# EAGLE schematic UTX_EE445M_Front_LiDAR_Board_1 (EAGLE 9.2.2)
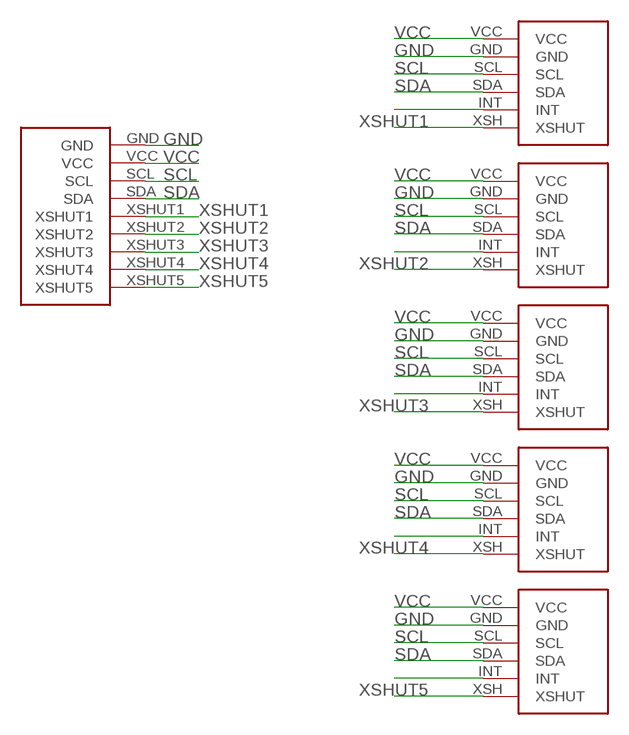
[diagram p0: schematic, sheet 1]

## Parts
U$1  UTX_EE445M_LIDAR_FRONT_BOARD_CONNECTOR_PTH  [UTX_EE445M_LIDAR_FRONT_BOARD_CONNECTOR_PTH]
U$2  LIDAR_VL53L0X_ATK_VERT  [LIDAR_VL53L0X_ATK_VERT]
U$3  LIDAR_VL53L0X_ATK_VERT  [LIDAR_VL53L0X_ATK_VERT]
U$4  LIDAR_VL53L0X_ATK_VERT  [LIDAR_VL53L0X_ATK_VERT]
U$5  LIDAR_VL53L0X_ATK_VERT  [LIDAR_VL53L0X_ATK_VERT]
U$6  LIDAR_VL53L0X_ATK_VERT  [LIDAR_VL53L0X_ATK_VERT]

## Nets
GND: U$1.GND U$2.GND U$3.GND U$4.GND U$5.GND U$6.GND
N$1: U$3.INT
N$2: U$6.INT
N$3: U$4.INT
N$5: U$5.INT
N$13: U$2.INT
SCL: U$1.SCL U$2.SCL U$3.SCL U$4.SCL U$5.SCL U$6.SCL
SDA: U$1.SDA U$2.SDA U$3.SDA U$4.SDA U$5.SDA U$6.SDA
VCC: U$1.VCC U$2.VCC U$3.VCC U$4.VCC U$5.VCC U$6.VCC
XSHUT1: U$1.XSHUT1 U$2.XSH(XSHUT)
XSHUT2: U$1.XSHUT2 U$3.XSH(XSHUT)
XSHUT3: U$1.XSHUT3 U$4.XSH(XSHUT)
XSHUT4: U$1.XSHUT4 U$5.XSH(XSHUT)
XSHUT5: U$1.XSHUT5 U$6.XSH(XSHUT)

## Library data of the parts
U$1 = Z:UTX_EE445M_LIDAR_FRONT_BOARD_CONNECTOR_PTH
U$2-U$6 = Z:LIDAR_VL53L0X_ATK_VERT